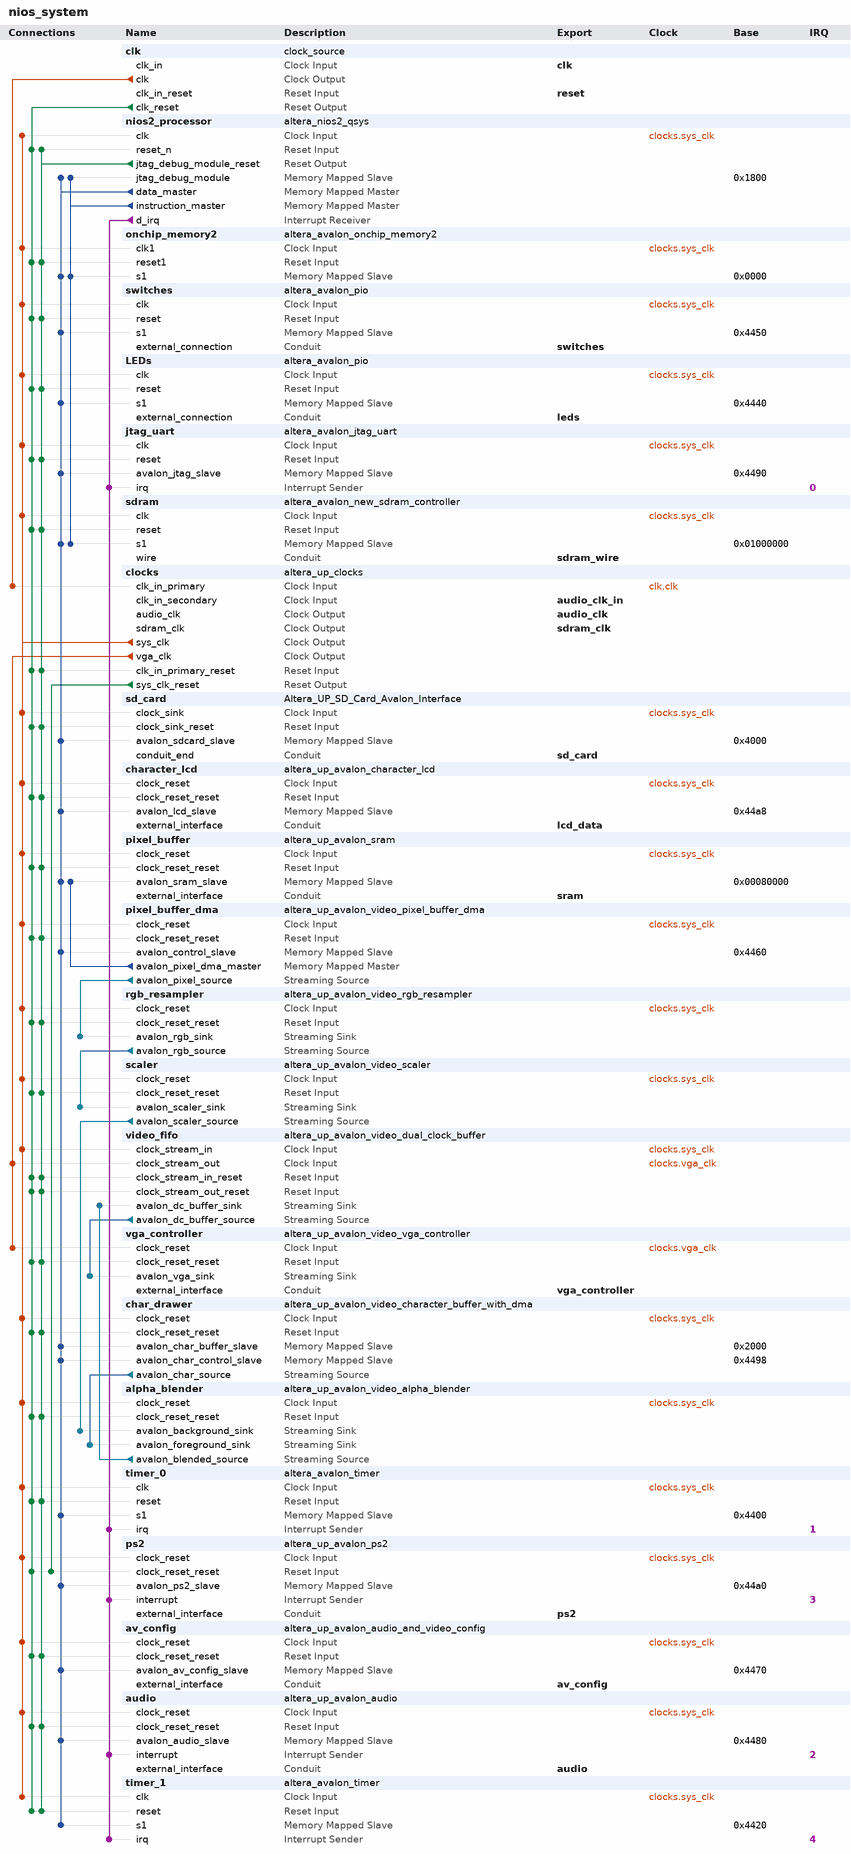
[diagram p0: system contents]
# Platform Designer (Qsys) system nios_system, Cyclone II EP2C35F672C6
# Parameters at their usual value, and those the tool derives, are not listed.
package require -exact qsys 12.0
create_system nios_system
set_project_property DEVICE_FAMILY {Cyclone II}
set_project_property DEVICE EP2C35F672C6

add_instance clk clock_source 12.0
set_instance_parameter_value clk clockFrequency 50000000

add_instance nios2_processor altera_nios2_qsys 12.0
set_instance_parameter_value nios2_processor resetSlave sdram.s1
set_instance_parameter_value nios2_processor exceptionSlave sdram.s1
set_instance_parameter_value nios2_processor breakSlave nios2_processor.jtag_debug_module
set_instance_parameter_value nios2_processor muldiv_multiplierType NoneSmall
set_instance_parameter_value nios2_processor impl Fast
set_instance_parameter_value nios2_processor icache_size 4096

add_instance onchip_memory2 altera_avalon_onchip_memory2 12.0
set_instance_parameter_value onchip_memory2 dataWidth 32
set_instance_parameter_value onchip_memory2 dualPort false
set_instance_parameter_value onchip_memory2 initMemContent true
set_instance_parameter_value onchip_memory2 initializationFileName onchip_memory2
set_instance_parameter_value onchip_memory2 memorySize 4096

add_instance switches altera_avalon_pio 12.0
set_instance_parameter_value switches direction Input
set_instance_parameter_value switches width 8

add_instance LEDs altera_avalon_pio 12.0
set_instance_parameter_value LEDs direction Output
set_instance_parameter_value LEDs width 8

add_instance jtag_uart altera_avalon_jtag_uart 12.0
set_instance_parameter_value jtag_uart simInteractiveOptions INTERACTIVE_ASCII_OUTPUT

add_instance sdram altera_avalon_new_sdram_controller 12.0
set_instance_parameter_value sdram TAC 5.5
set_instance_parameter_value sdram TRCD 20.0
set_instance_parameter_value sdram TRP 20.0
set_instance_parameter_value sdram casLatency 3
set_instance_parameter_value sdram columnWidth 8
set_instance_parameter_value sdram dataWidth 16
set_instance_parameter_value sdram generateSimulationModel false
set_instance_parameter_value sdram model custom
set_instance_parameter_value sdram numberOfBanks 4
set_instance_parameter_value sdram numberOfChipSelects 1
set_instance_parameter_value sdram powerUpDelay 100.0
set_instance_parameter_value sdram refreshPeriod 15.625
set_instance_parameter_value sdram rowWidth 12

add_instance clocks altera_up_clocks 12.0
set_instance_parameter_value clocks board DE2
set_instance_parameter_value clocks vga_clk true
set_instance_parameter_value clocks audio_clk true
set_instance_parameter_value clocks audio_clk_freq 12.288

add_instance sd_card Altera_UP_SD_Card_Avalon_Interface 1.0

add_instance character_lcd altera_up_avalon_character_lcd 12.0
set_instance_parameter_value character_lcd cursor Normal

add_instance pixel_buffer altera_up_avalon_sram 12.0
set_instance_parameter_value pixel_buffer board DE2
set_instance_parameter_value pixel_buffer pixel_buffer true

add_instance pixel_buffer_dma altera_up_avalon_video_pixel_buffer_dma 12.0
set_instance_parameter_value pixel_buffer_dma addr_mode X-Y
set_instance_parameter_value pixel_buffer_dma start_address 0
set_instance_parameter_value pixel_buffer_dma back_start_address 0
set_instance_parameter_value pixel_buffer_dma image_width 320
set_instance_parameter_value pixel_buffer_dma image_height 240
set_instance_parameter_value pixel_buffer_dma color_space {16-bit RGB}

add_instance rgb_resampler altera_up_avalon_video_rgb_resampler 12.0
set_instance_parameter_value rgb_resampler input_type {16-bit RGB}
set_instance_parameter_value rgb_resampler output_type {30-bit RGB}
set_instance_parameter_value rgb_resampler alpha 1023

add_instance scaler altera_up_avalon_video_scaler 12.0
set_instance_parameter_value scaler width_scaling 2
set_instance_parameter_value scaler height_scaling 2
set_instance_parameter_value scaler width_in 320
set_instance_parameter_value scaler color_bits 10
set_instance_parameter_value scaler color_planes 3

add_instance video_fifo altera_up_avalon_video_dual_clock_buffer 12.0
set_instance_parameter_value video_fifo color_bits 10

add_instance vga_controller altera_up_avalon_video_vga_controller 12.0
set_instance_parameter_value vga_controller board DE2

add_instance char_drawer altera_up_avalon_video_character_buffer_with_dma 12.0
set_instance_parameter_value char_drawer enable_transparency true

add_instance alpha_blender altera_up_avalon_video_alpha_blender 12.0

add_instance timer_0 altera_avalon_timer 12.0
set_instance_parameter_value timer_0 period 1
set_instance_parameter_value timer_0 periodUnits MSEC
set_instance_parameter_value timer_0 timerPreset FULL_FEATURED

add_instance ps2 altera_up_avalon_ps2 12.0

add_instance av_config altera_up_avalon_audio_and_video_config 12.0
set_instance_parameter_value av_config board DE2
set_instance_parameter_value av_config audio_in {Microphone to ADC}
set_instance_parameter_value av_config line_in_bypass false
set_instance_parameter_value av_config bit_length 16
set_instance_parameter_value av_config sampling_rate {32 kHz}

add_instance audio altera_up_avalon_audio 12.0
set_instance_parameter_value audio avalon_bus_type {Memory Mapped}
set_instance_parameter_value audio audio_in true
set_instance_parameter_value audio dw 16

add_instance timer_1 altera_avalon_timer 12.0
set_instance_parameter_value timer_1 period 1
set_instance_parameter_value timer_1 periodUnits MSEC
set_instance_parameter_value timer_1 timerPreset FULL_FEATURED

# connections
add_connection clk.clk clocks.clk_in_primary clock
add_connection clocks.sys_clk alpha_blender.clock_reset clock
add_connection clocks.sys_clk audio.clock_reset clock
add_connection clocks.sys_clk av_config.clock_reset clock
add_connection clocks.sys_clk char_drawer.clock_reset clock
add_connection clocks.sys_clk character_lcd.clock_reset clock
add_connection clocks.sys_clk jtag_uart.clk clock
add_connection clocks.sys_clk LEDs.clk clock
add_connection clocks.sys_clk nios2_processor.clk clock
add_connection clocks.sys_clk onchip_memory2.clk1 clock
add_connection clocks.sys_clk pixel_buffer.clock_reset clock
add_connection clocks.sys_clk pixel_buffer_dma.clock_reset clock
add_connection clocks.sys_clk ps2.clock_reset clock
add_connection clocks.sys_clk rgb_resampler.clock_reset clock
add_connection clocks.sys_clk scaler.clock_reset clock
add_connection clocks.sys_clk sd_card.clock_sink clock
add_connection clocks.sys_clk sdram.clk clock
add_connection clocks.sys_clk switches.clk clock
add_connection clocks.sys_clk timer_0.clk clock
add_connection clocks.sys_clk timer_1.clk clock
add_connection clocks.sys_clk video_fifo.clock_stream_in clock
add_connection clocks.vga_clk vga_controller.clock_reset clock
add_connection clocks.vga_clk video_fifo.clock_stream_out clock
add_connection clk.clk_reset alpha_blender.clock_reset_reset reset
add_connection clk.clk_reset audio.clock_reset_reset reset
add_connection clk.clk_reset av_config.clock_reset_reset reset
add_connection clk.clk_reset char_drawer.clock_reset_reset reset
add_connection clk.clk_reset character_lcd.clock_reset_reset reset
add_connection clk.clk_reset clocks.clk_in_primary_reset reset
add_connection clk.clk_reset jtag_uart.reset reset
add_connection clk.clk_reset LEDs.reset reset
add_connection clk.clk_reset nios2_processor.reset_n reset
add_connection clk.clk_reset onchip_memory2.reset1 reset
add_connection clk.clk_reset pixel_buffer.clock_reset_reset reset
add_connection clk.clk_reset pixel_buffer_dma.clock_reset_reset reset
add_connection clk.clk_reset ps2.clock_reset_reset reset
add_connection clk.clk_reset rgb_resampler.clock_reset_reset reset
add_connection clk.clk_reset scaler.clock_reset_reset reset
add_connection clk.clk_reset sd_card.clock_sink_reset reset
add_connection clk.clk_reset sdram.reset reset
add_connection clk.clk_reset switches.reset reset
add_connection clk.clk_reset timer_0.reset reset
add_connection clk.clk_reset timer_1.reset reset
add_connection clk.clk_reset vga_controller.clock_reset_reset reset
add_connection clk.clk_reset video_fifo.clock_stream_in_reset reset
add_connection clk.clk_reset video_fifo.clock_stream_out_reset reset
add_connection clocks.sys_clk_reset ps2.clock_reset_reset reset
add_connection nios2_processor.jtag_debug_module_reset alpha_blender.clock_reset_reset reset
add_connection nios2_processor.jtag_debug_module_reset audio.clock_reset_reset reset
add_connection nios2_processor.jtag_debug_module_reset av_config.clock_reset_reset reset
add_connection nios2_processor.jtag_debug_module_reset char_drawer.clock_reset_reset reset
add_connection nios2_processor.jtag_debug_module_reset character_lcd.clock_reset_reset reset
add_connection nios2_processor.jtag_debug_module_reset clocks.clk_in_primary_reset reset
add_connection nios2_processor.jtag_debug_module_reset jtag_uart.reset reset
add_connection nios2_processor.jtag_debug_module_reset LEDs.reset reset
add_connection nios2_processor.jtag_debug_module_reset nios2_processor.reset_n reset
add_connection nios2_processor.jtag_debug_module_reset onchip_memory2.reset1 reset
add_connection nios2_processor.jtag_debug_module_reset pixel_buffer.clock_reset_reset reset
add_connection nios2_processor.jtag_debug_module_reset pixel_buffer_dma.clock_reset_reset reset
add_connection nios2_processor.jtag_debug_module_reset rgb_resampler.clock_reset_reset reset
add_connection nios2_processor.jtag_debug_module_reset scaler.clock_reset_reset reset
add_connection nios2_processor.jtag_debug_module_reset sd_card.clock_sink_reset reset
add_connection nios2_processor.jtag_debug_module_reset sdram.reset reset
add_connection nios2_processor.jtag_debug_module_reset switches.reset reset
add_connection nios2_processor.jtag_debug_module_reset timer_0.reset reset
add_connection nios2_processor.jtag_debug_module_reset timer_1.reset reset
add_connection nios2_processor.jtag_debug_module_reset vga_controller.clock_reset_reset reset
add_connection nios2_processor.jtag_debug_module_reset video_fifo.clock_stream_in_reset reset
add_connection nios2_processor.jtag_debug_module_reset video_fifo.clock_stream_out_reset reset
add_connection nios2_processor.data_master audio.avalon_audio_slave avalon
set_connection_parameter_value nios2_processor.data_master/audio.avalon_audio_slave baseAddress 0x4480
add_connection nios2_processor.data_master av_config.avalon_av_config_slave avalon
set_connection_parameter_value nios2_processor.data_master/av_config.avalon_av_config_slave baseAddress 0x4470
add_connection nios2_processor.data_master char_drawer.avalon_char_buffer_slave avalon
set_connection_parameter_value nios2_processor.data_master/char_drawer.avalon_char_buffer_slave baseAddress 0x2000
add_connection nios2_processor.data_master char_drawer.avalon_char_control_slave avalon
set_connection_parameter_value nios2_processor.data_master/char_drawer.avalon_char_control_slave baseAddress 0x4498
add_connection nios2_processor.data_master character_lcd.avalon_lcd_slave avalon
set_connection_parameter_value nios2_processor.data_master/character_lcd.avalon_lcd_slave baseAddress 0x44a8
add_connection nios2_processor.data_master jtag_uart.avalon_jtag_slave avalon
set_connection_parameter_value nios2_processor.data_master/jtag_uart.avalon_jtag_slave baseAddress 0x4490
add_connection nios2_processor.data_master LEDs.s1 avalon
set_connection_parameter_value nios2_processor.data_master/LEDs.s1 baseAddress 0x4440
add_connection nios2_processor.data_master nios2_processor.jtag_debug_module avalon
set_connection_parameter_value nios2_processor.data_master/nios2_processor.jtag_debug_module baseAddress 0x1800
add_connection nios2_processor.data_master onchip_memory2.s1 avalon
set_connection_parameter_value nios2_processor.data_master/onchip_memory2.s1 baseAddress 0x0000
add_connection nios2_processor.data_master pixel_buffer.avalon_sram_slave avalon
set_connection_parameter_value nios2_processor.data_master/pixel_buffer.avalon_sram_slave baseAddress 0x00080000
add_connection nios2_processor.data_master pixel_buffer_dma.avalon_control_slave avalon
set_connection_parameter_value nios2_processor.data_master/pixel_buffer_dma.avalon_control_slave baseAddress 0x4460
add_connection nios2_processor.data_master ps2.avalon_ps2_slave avalon
set_connection_parameter_value nios2_processor.data_master/ps2.avalon_ps2_slave baseAddress 0x44a0
add_connection nios2_processor.data_master sd_card.avalon_sdcard_slave avalon
set_connection_parameter_value nios2_processor.data_master/sd_card.avalon_sdcard_slave baseAddress 0x4000
add_connection nios2_processor.data_master sdram.s1 avalon
set_connection_parameter_value nios2_processor.data_master/sdram.s1 baseAddress 0x01000000
add_connection nios2_processor.data_master switches.s1 avalon
set_connection_parameter_value nios2_processor.data_master/switches.s1 baseAddress 0x4450
add_connection nios2_processor.data_master timer_0.s1 avalon
set_connection_parameter_value nios2_processor.data_master/timer_0.s1 baseAddress 0x4400
add_connection nios2_processor.data_master timer_1.s1 avalon
set_connection_parameter_value nios2_processor.data_master/timer_1.s1 baseAddress 0x4420
add_connection nios2_processor.instruction_master nios2_processor.jtag_debug_module avalon
set_connection_parameter_value nios2_processor.instruction_master/nios2_processor.jtag_debug_module baseAddress 0x1800
add_connection nios2_processor.instruction_master onchip_memory2.s1 avalon
set_connection_parameter_value nios2_processor.instruction_master/onchip_memory2.s1 baseAddress 0x0000
add_connection nios2_processor.instruction_master sdram.s1 avalon
set_connection_parameter_value nios2_processor.instruction_master/sdram.s1 baseAddress 0x01000000
add_connection pixel_buffer_dma.avalon_pixel_dma_master pixel_buffer.avalon_sram_slave avalon
set_connection_parameter_value pixel_buffer_dma.avalon_pixel_dma_master/pixel_buffer.avalon_sram_slave baseAddress 0x00080000
add_connection alpha_blender.avalon_blended_source video_fifo.avalon_dc_buffer_sink avalon_streaming
add_connection char_drawer.avalon_char_source alpha_blender.avalon_foreground_sink avalon_streaming
add_connection pixel_buffer_dma.avalon_pixel_source rgb_resampler.avalon_rgb_sink avalon_streaming
add_connection rgb_resampler.avalon_rgb_source scaler.avalon_scaler_sink avalon_streaming
add_connection scaler.avalon_scaler_source alpha_blender.avalon_background_sink avalon_streaming
add_connection video_fifo.avalon_dc_buffer_source vga_controller.avalon_vga_sink avalon_streaming
add_connection nios2_processor.d_irq audio.interrupt interrupt
set_connection_parameter_value nios2_processor.d_irq/audio.interrupt irqNumber 2
add_connection nios2_processor.d_irq jtag_uart.irq interrupt
set_connection_parameter_value nios2_processor.d_irq/jtag_uart.irq irqNumber 0
add_connection nios2_processor.d_irq ps2.interrupt interrupt
set_connection_parameter_value nios2_processor.d_irq/ps2.interrupt irqNumber 3
add_connection nios2_processor.d_irq timer_0.irq interrupt
set_connection_parameter_value nios2_processor.d_irq/timer_0.irq irqNumber 1
add_connection nios2_processor.d_irq timer_1.irq interrupt
set_connection_parameter_value nios2_processor.d_irq/timer_1.irq irqNumber 4

# exported interfaces
add_interface clk clock sink
set_interface_property clk EXPORT_OF clk.clk_in
add_interface reset reset sink
set_interface_property reset EXPORT_OF clk.clk_in_reset
add_interface switches conduit end
set_interface_property switches EXPORT_OF switches.external_connection
add_interface leds conduit end
set_interface_property leds EXPORT_OF LEDs.external_connection
add_interface sdram_wire conduit end
set_interface_property sdram_wire EXPORT_OF sdram.wire
add_interface sdram_clk clock source
set_interface_property sdram_clk EXPORT_OF clocks.sdram_clk
add_interface lcd_data conduit end
set_interface_property lcd_data EXPORT_OF character_lcd.external_interface
add_interface sram conduit end
set_interface_property sram EXPORT_OF pixel_buffer.external_interface
add_interface vga_controller conduit end
set_interface_property vga_controller EXPORT_OF vga_controller.external_interface
add_interface sd_card conduit end
set_interface_property sd_card EXPORT_OF sd_card.conduit_end
add_interface av_config conduit end
set_interface_property av_config EXPORT_OF av_config.external_interface
add_interface audio_clk clock source
set_interface_property audio_clk EXPORT_OF clocks.audio_clk
add_interface audio_clk_in clock sink
set_interface_property audio_clk_in EXPORT_OF clocks.clk_in_secondary
add_interface audio conduit end
set_interface_property audio EXPORT_OF audio.external_interface
add_interface ps2 conduit end
set_interface_property ps2 EXPORT_OF ps2.external_interface

save_system nios_system.qsys
